# EAGLE schematic side (EAGLE 9.6.1)
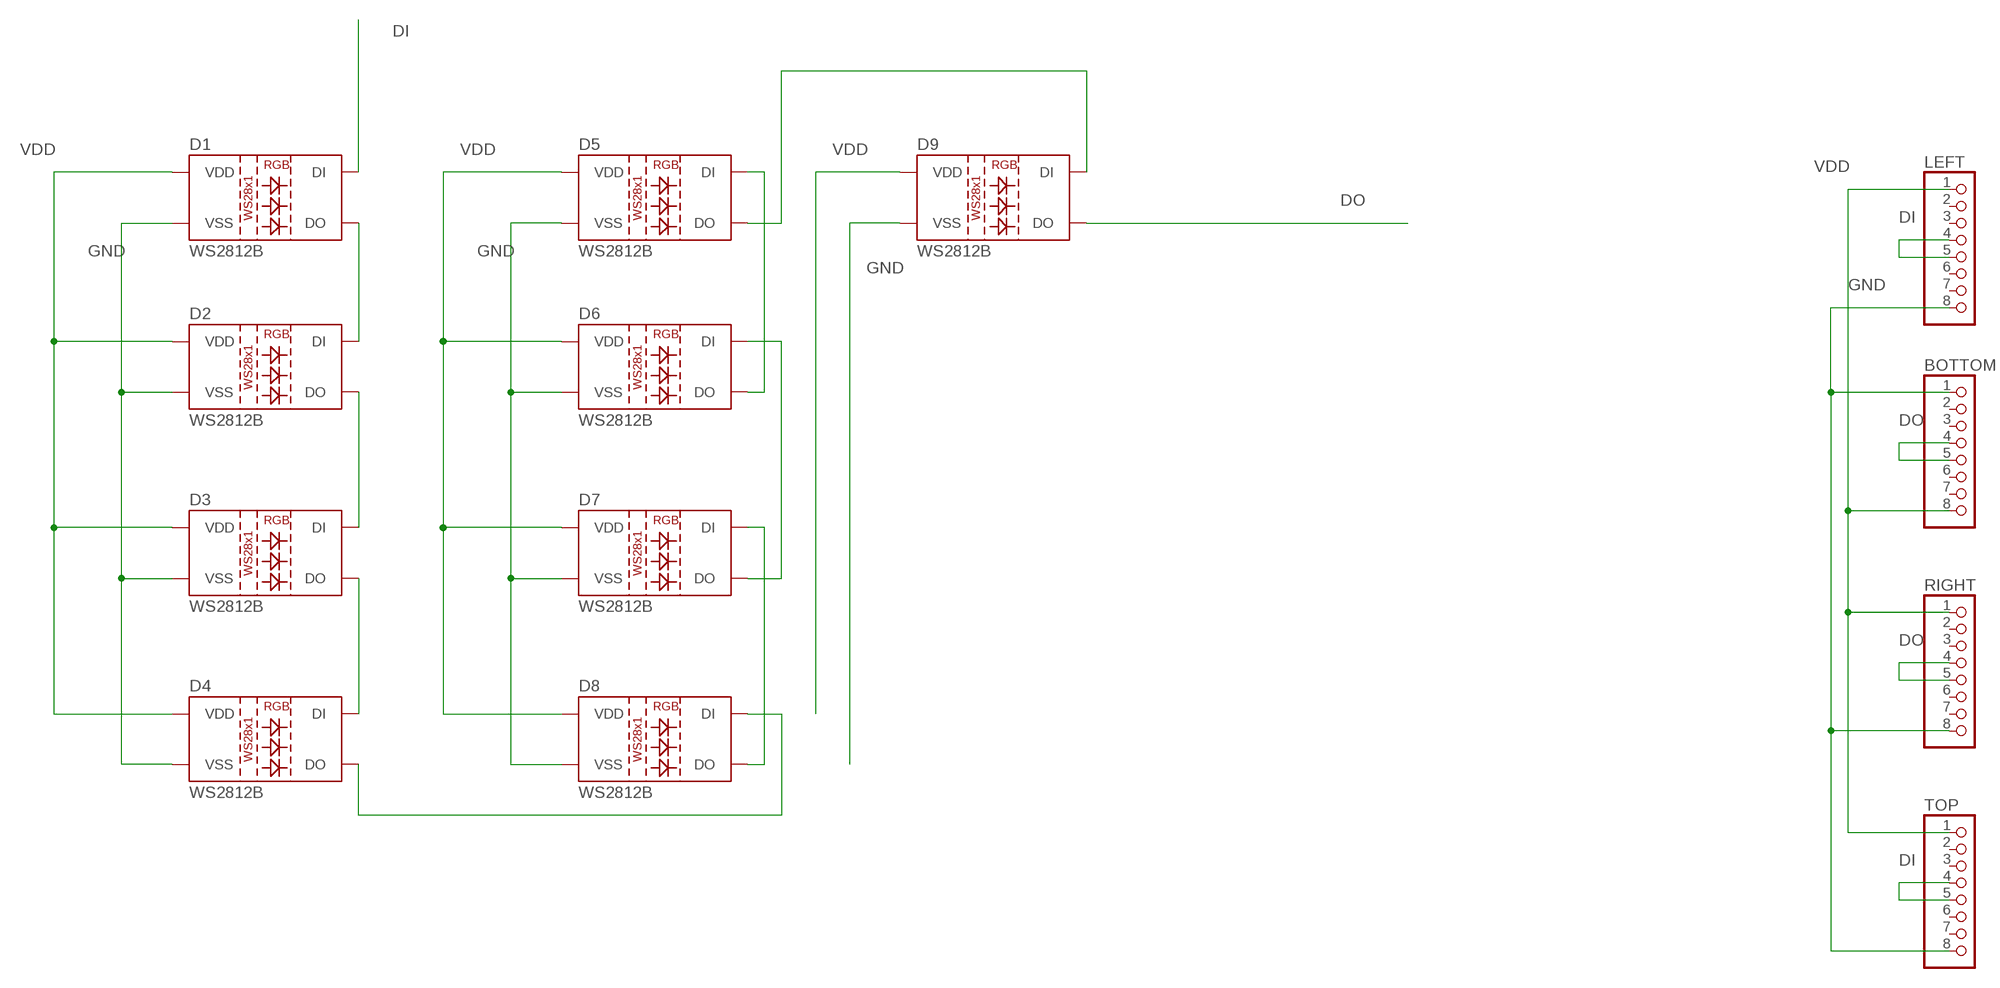
[diagram p0: schematic, sheet 1]

## Parts
BOTTOM  PINHD-1X8  [1X08]
D1  WS2812B  [WS2812B]
D2  WS2812B  [WS2812B]
D3  WS2812B  [WS2812B]
D4  WS2812B  [WS2812B]
D5  WS2812B  [WS2812B]
D6  WS2812B  [WS2812B]
D7  WS2812B  [WS2812B]
D8  WS2812B  [WS2812B]
D9  WS2812B  [WS2812B]
LEFT  PINHD-1X8  [1X08]
RIGHT  PINHD-1X8  [1X08]
TOP  PINHD-1X8  [1X08]

## Nets
DI: D1.4(DI) LEFT.4 LEFT.5 TOP.4 TOP.5
DO: BOTTOM.4 BOTTOM.5 D9.2(DO) RIGHT.4 RIGHT.5
GND: BOTTOM.8 D1.3(VSS) D2.3(VSS) D3.3(VSS) D4.3(VSS) D5.3(VSS) D6.3(VSS) D7.3(VSS) D8.3(VSS) D9.3(VSS) LEFT.1 RIGHT.1 TOP.1
N$1: D4.2(DO) D8.4(DI)
N$2: D7.4(DI) D8.2(DO)
N$3: D1.2(DO) D2.4(DI)
N$4: D2.2(DO) D3.4(DI)
N$5: D3.2(DO) D4.4(DI)
N$6: D6.4(DI) D7.2(DO)
N$7: D5.2(DO) D9.4(DI)
N$16: D5.4(DI) D6.2(DO)
VDD [pow_width]: BOTTOM.1 D1.1(VDD) D2.1(VDD) D3.1(VDD) D4.1(VDD) D5.1(VDD) D6.1(VDD) D7.1(VDD) D8.1(VDD) D9.1(VDD) LEFT.8 RIGHT.8 TOP.8
Unconnected: BOTTOM.2 BOTTOM.3 BOTTOM.6 BOTTOM.7 LEFT.2 LEFT.3 LEFT.6 LEFT.7 RIGHT.2 RIGHT.3 RIGHT.6 RIGHT.7 TOP.2 TOP.3 TOP.6 TOP.7

## Library data of the parts
BOTTOM LEFT RIGHT TOP = pinhead:PINHD-1X8: PIN HEADER
D1-D9 = my-LED-cube:WS2812B: WS2812B SMD addressable RGB LED 5x5mm SMD LED with built-in controller IC. Color: Red/Green/Blue mC Rating: RGB: 390, 660, 180 mcd Forward Voltage: RGB: 2.0, 3.0, 3.0 V Packages:WS2812B SparkFun Products: Blynk Board - ESP8266 <https://www.sparkfun.com/products/13794>; PROD_ID: DIO-12503

## Net classes
1 pow_width: width 0.102 mm